# Altium schematic sheet Booster_RF_CH_SUP_CTRL.SchDoc: Booster RF channel
size 420 x 297 mm; Author: G.K.; CompanyName: WUT; DrawnBy: G.K.; Organization: CERN; Address1: Warsaw Univeristy of Technology; Address2: Nowowiejska 15/19; Revision: -; SheetNumber: -; SheetTotal: -; EDA_Number: ARTIQ; Projet: ADC/DAC MEZZANINE; ModifiedBy: -; CreateDate: XX/XX/XXXX; CheckedDate: -; Title2: supply & control; DivGrp: ISE; Designer: G.K.; ModifiedDate: -; ProjectName: ADC/DAC MEZZANINE
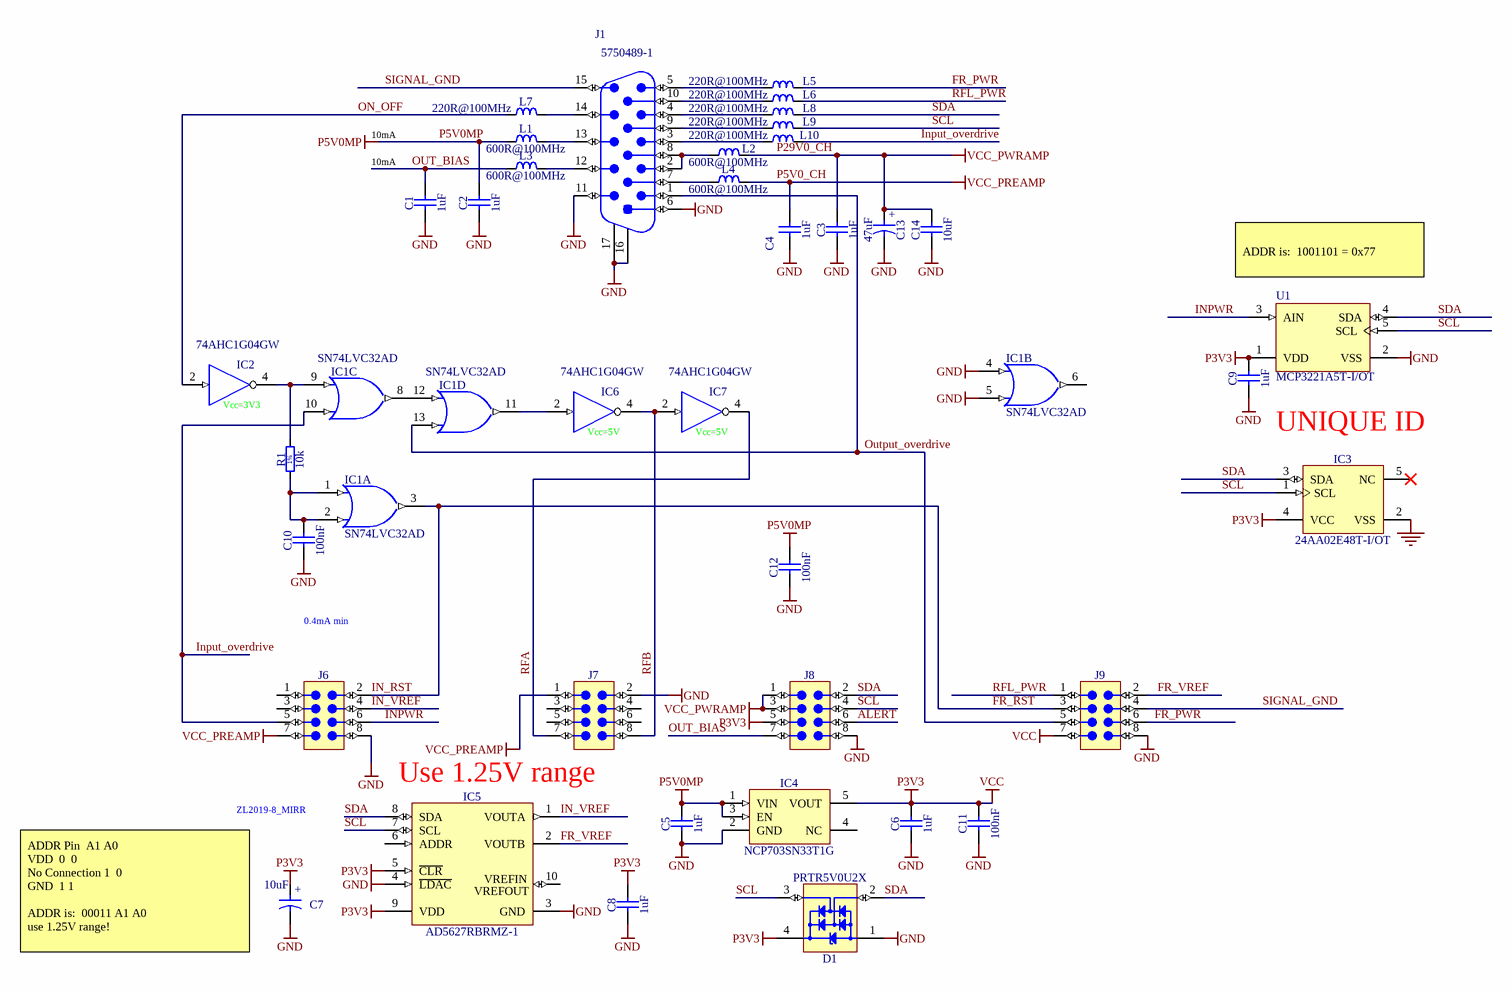
[diagram p0: Booster_RF_CH_SUP_CTRL.SchDoc]

## Parts
C1  1uF  [CAPC2012X110N]
C2  1uF  [CAPC2012X110N]
C3  1uF  [CAPC2012X110N]
C4  1uF  [CAPC2012X110N]
C5  1uF  [CAPC2012X140N]
C6  1uF  [CAPC2012X140N]
C7  10uF  [CAPMP3216X180N]
C8  1uF  [CAPC2012X140N]
C9  1uF  [CAPC2012X140N]
C10  100nF  [CAPC1005X55N]
C11  100nF  [CAPC1005X55N]
C12  100nF  [CAPC1005X55N]
C13  47uF  [CAPMP7343X430N]
C14  10uF  [CAPC3216X190N]
D1  PRTR5V0U2X  [SOT190P230X110-4N]
IC1  SN74LVC32AD  [SOIC127P600X175-14N]  (parts A,B,C,D of 4)
IC2  74AHC1G04GW  [SOT65P212X110-5N]
IC3  24AA02E48T-I/OT  [SOT95P280X145-5N]
IC4  NCP703SN33T1G  [SOT95P275X110-5N]
IC5  AD5627RBRMZ-1  [SOP50P490X110-10N]
IC6  74AHC1G04GW  [SOT65P212X110-5N]
IC7  74AHC1G04GW  [SOT65P212X110-5N]
J1  Manufacturer Part Number: 5750489-1  [TYCO_5750489-1]  (hidden comment: HD-Sub)
J6  Header 8  [ZL2019-8_MIRR]  (value not drawn)
J7  Header 8  [ZL2019-8_MIRR]  (value not drawn)
J8  Header 8  [ZL2019-8_MIRR]  (value not drawn)
J9  Header 8  [ZL2019-8_MIRR]  (value not drawn)
L1  600R@100MHz  [INDC3216X130N]
L2  600R@100MHz  [INDC3216X130N]
L3  600R@100MHz  [INDC3216X130N]
L4  600R@100MHz  [INDC3216X130N]
L5  220R@100MHz  [INDC1005X55N]
L6  220R@100MHz  [INDC1005X55N]
L7  220R@100MHz  [INDC1005X55N]
L8  220R@100MHz  [INDC1005X55N]
L9  220R@100MHz  [INDC1005X55N]
L10  220R@100MHz  [INDC1005X55N]
R1  10k  [RESC1608X55N]
U1  MCP3221A5T-I/OT  [SOT-23-OT5_L]

## Nets
GND: C1.1 C2.1 C3.1 C4.1 C5.1 C6.1 C7.2 C8.1 C9.1 C10.1 C11.1 C12.1 C13.2 C14.1 D1.1(GND) IC1.4(A) IC1.5(B) IC1.7(GND) IC2.3(GND) IC3.2(VSS) IC4.2(GND) IC5.3(GND) IC5.4(~{LDAC}) IC6.3(GND) IC7.3(GND) J1.6 J1.11 J1.16 J1.17 J6.8 J7.2 J8.8 J9.8 U1.2(VSS)
P3V3: C6.2 C7.1 C8.2 C9.2 C11.2 D1.4(VCC) IC1.14(VCC) IC2.5(VCC) IC3.4(VCC) IC4.5(VOUT) IC5.5(~{CLR}) IC5.9(VDD) J8.5 J9.7 U1.1(VDD)  [also labelled VCC]
P5V0_CH: C4.2 J6.7 J7.1 L4.2  [also labelled VCC_PREAMP]
P5V0MP: C2.2 C5.2 C12.2 IC4.1(VIN) IC4.3(EN) IC6.5(VCC) IC7.5(VCC) L1.1
P29V0_CH: C3.2 C13.1 C14.2 J8.1 J8.3 L2.2  [also labelled VCC_PWRAMP]
ALERT: J8.6
FR_PWR: J9.6 L5.2
FR_RST: IC1.3(Y) J6.2 J9.3  [also labelled IN_RST]
FR_VREF: IC5.2(VOUTB) J9.2
IN_VREF: IC5.1(VOUTA) J6.4
Input_overdrive: IC1.10(B) J6.5 L10.2
INPWR: J6.6 U1.3(AIN)
ON_OFF: IC2.2(IN) L7.1
OUT_BIAS: C1.2 J8.7 L3.1
Output_overdrive: IC1.13(B) J1.1 J9.5
RFA: IC7.4(OUT) J7.7
RFB: IC6.4(OUT) IC7.2(IN) J7.8
RFL_PWR: J9.1 L6.2
SCL: D1.3(I/O2) IC3.1(SCL) IC5.7(SCL) J8.4 L9.2 U1.5(SCL)
SDA: D1.2(I/O1) IC3.3(SDA) IC5.8(SDA) J8.2 L8.2 U1.4(SDA)
SIGNAL_GND: J1.15 J9.4
NetC10_2: C10.2 IC1.1(A) IC1.2(B) R1.1
NetIC1_8: IC1.8(Y) IC1.12(A)
NetIC1_9: IC1.9(A) IC2.4(OUT) R1.2
NetIC1_11: IC1.11(Y) IC6.2(IN)
NetJ1_2: J1.2 J1.8 L2.1
NetJ1_3: J1.3 L10.1
NetJ1_4: J1.4 L8.1
NetJ1_5: J1.5 L5.1
NetJ1_7: J1.7 L4.1
NetJ1_9: J1.9 L9.1
NetJ1_10: J1.10 L6.1
NetJ1_12: J1.12 L3.2
NetJ1_13: J1.13 L1.2
NetJ1_14: J1.14 L7.2

Not connected (* = marked no-connect by the designer): IC1 6(Y); IC3 5(NC)*; IC4 4(NC); IC5 6(ADDR) 10(VREFIN/VREFOUT); J6 1 3; J7 3 4 5 6

## Notes on the sheet
- (near C1) 10mA
- 10mA
- (near U1) ADDR is:  1001101 = 0x77
- (near IC2) Vcc=3V3
- (near IC6) Vcc=5V
- (near IC7) Vcc=5V
- UNIQUE ID
- 0.4mA min
- Use 1.25V range
- ZL2019-8_MIRR
- (near C7) ADDR Pin		A1	A0
  VDD		0 	0
  No Connection	1 	0
  GND		1	1
  ADDR is:  00011 A1 A0
  use 1.25V range!
- Project/Equipment
- Document
- Designer
- Drawn by
- Check.by
- File
- Last Mod.
- Print Date
- Sheet
- Size
- A3
- of
- Rev
- (in symbol AD5627RBRMZ-1) VREFIN; VREFOUT
- (in symbol CTE3216-18_10UF_16V_20%_AVX_TCJ) +
- (in symbol CTE7343-43_47UF_35V_10%_LESR0300) +
- (in symbol R0603_10K_1%_0.1W_100PPM) 1%

## Library data of the parts
C1-C4 = CC0805_1UF_50V_10%_X7R: Non-polarised capacitor; Part Description: SMD Multilayer Chip Ceramic Capacitor; Manufacturer: GENERIC; Manufacturer1 Part Number: C0805C105K5RACTU; Voltage: 50V; TC: X7R; Tolerance: ±10%; Part Number: CC0805_1UF_50V_10%_X7R; Component Kind: Standard; Component Type: Standard; Pin Count: 2; Value: 1uF; Status: Preferred; Manufacturer Part Number: CC0805_1UF_50V_10%_X7R; Case: 0805; Mounted: Yes; Socket: No; SMD: Yes; Sense: No; Manufacturer1 Example: KEMET; Manufacturer1 ComponentHeight: 1.1mm; HelpURL: \\cern.ch\dfs\Applications\Altium\Datasheets\CC0805_X7R_KEMET.pdf; Author: CERN DEM JLC; CreateDate: 04.12.2013; LatestRevisionDate: 04.12.2013
C5 C6 C8 C9 = CC0805_1UF_35V_20%_X7R: Non-polarised capacitor; Part Description: SMD Multilayer Chip Ceramic Capacitor; Manufacturer: GENERIC; Manufacturer1 Part Number: GMK212B7105MG-T; Voltage: 35V; TC: X7R; Tolerance: ±20%; Part Number: CC0805_1UF_35V_20%_X7R; Component Kind: Standard; Component Type: Standard; Pin Count: 2; Value: 1uF; Status: Not Recommended; Manufacturer Part Number: CC0805_1UF_35V_20%_X7R; Case: 0805; Mounted: Yes; Socket: No; SMD: Yes; Sense: No; Manufacturer1 Example: TAIYO YUDEN; Manufacturer1 ComponentHeight: 1.35mm; HelpURL: \\cern.ch\dfs\Applications\Altium\Datasheets\CC0805_X7R_TAIYO-YUDEN_HIGH-VALUE.pdf; Author: CERN DEM JLC; CreateDate: 22.06.2011; LatestRevisionDate: 22.06.2011
C7 = CTE3216-18_10UF_16V_20%_AVX_TCJ: Polarised capacitor; Part Description: ESR 0R200 Tantalum Solid Electrolytic Chip Capacitor with Conductive Polymer Electrode; Manufacturer: AVX; Manufacturer Part Number: TCJA106M016R0200; Voltage: 16V; Tolerance: ±20%; Part Number: CTE3216-18_10UF_16V_20%_AVX_TCJ; Component Kind: Standard; Component Type: Standard; Pin Count: 2; Value: 10uF; Status: Preferred; Case: A; Mounted: Yes; Socket: No; SMD: Yes; Sense: No; ComponentHeight: 1.8mm; HelpURL: \\cern.ch\dfs\Applications\Altium\Datasheets\CTE_AVX_TCJ.pdf; Author: CERN DEM JLC; CreateDate: 29.03.2012; LatestRevisionDate: 29.03.2012
C10-C12 = CC0402_100NF_16V_10%_X5R: Non-polarised capacitor; Part Description: SMD Multilayer Chip Ceramic Capacitor; Manufacturer: GENERIC; Manufacturer1 Part Number: GRM155R61C104KA88D; Voltage: 16V; TC: X5R; Tolerance: ±10%; Part Number: CC0402_100NF_16V_10%_X5R; Component Kind: Standard; Component Type: Standard; Pin Count: 2; Value: 100nF; Status: None; Manufacturer Part Number: CC0402_100NF_16V_10%_X5R; Case: 0402; Mounted: Yes; Socket: No; SMD: Yes; Sense: No; Manufacturer1 Example: MURATA; Manufacturer1 ComponentHeight: 0.55mm; HelpURL: \\cern.ch\dfs\Applications\Altium\Datasheets\CC0402_X5R_MURATA_GRM.pdf; Author: CERN DEM JLC; CreateDate: 10.12.2013; LatestRevisionDate: 10.12.2013
C13 = CTE7343-43_47UF_35V_10%_LESR0300: Polarised capacitor; Part Description: ESR 0R3 Solid Tantalum Chip Capacitor; Manufacturer: GENERIC; Manufacturer1 Part Number: T495X476K035ATE300; Voltage: 35V; Tolerance: ±10%; Part Number: CTE7343-43_47UF_35V_10%_LESR0300; Component Kind: Standard; Component Type: Standard; Pin Count: 2; Value: 47uF; Status: Preferred; Manufacturer Part Number: CTE7343-43_47UF_35V_10%_LESR0300; Case: E; Mounted: Yes; Socket: No; SMD: Yes; Sense: No; Manufacturer1 Example: AVX; Manufacturer1 ComponentHeight: 4.3mm; HelpURL: \\cern.ch\dfs\Applications\Altium\Datasheets\CTEB_KEMET_T495.pdf; Author: CERN DEM JLC; CreateDate: 27.05.2013; LatestRevisionDate: 27.05.2013
C14 = CC1206_10UF_50V_10%_X5R_TDK_CGA5L3X5R1H106K160AB: Non-polarised capacitor; Part Description: SMD Multilayer Chip Ceramic Capacitor (Automotive Grade); Manufacturer: TDK; Voltage: 50V; TC: X5R; Tolerance: ±10%; Part Number: CC1206_10UF_50V_10%_X5R_TDK_CGA5L3X5R1H106K160AB; Component Kind: Standard; Component Type: Standard; Pin Count: 2; Value: 10uF; Status: Not Recommended; Manufacturer Part Number: CGA5L3X5R1H106K160AB; Case: 1206; Mounted: Yes; Socket: No; SMD: Yes; Sense: No; ComponentHeight: 1.9mm; HelpURL: \\cern.ch\dfs\Applications\Altium\Datasheets\CC1206_X5R_TDK_CGA.pdf; Author: CERN DEM BC; CreateDate: 29.02.2016; LatestRevisionDate: 13.09.2016
D1 = PRTR5V0U2X: Ultra Low Capacitance Double Rail-to-Rail ESD Protection Diode; Part Description: Ultra Low Capacitance (1pF) Double Rail-to-Rail ESD Protection Diode (8kV); Manufacturer: NXP SEMICONDUCTORS; Voltage: 5.5V; PressFit: No; Bonding: No; Part Number: PRTR5V0U2X; Component Kind: Standard; Component Type: Standard; Device: PRTR5V0U2X; PackageDescription: SOT143B, SOT, 1.90mm Pitch; 4 Pin, 1.30mm W X 2.90mm L X 1.10mm H body, IPC Medium Density; Manufacturer Part Number: PRTR5V0U2X; Pin Count: 4; Case: SOT143B; Mounted: Yes; Socket: No; SMD: Yes; Sense: No; ComponentHeight: 1.1mm; HelpURL: \\cern.ch\dfs\Applications\Altium\Datasheets\PRTR5V0U2X.pdf; Author: CERN DEM JLC; CreateDate: 22.03.2011; LatestRevisionDate: 22.03.2011
IC1 = SN74LVC32AD: Quad 2-Input OR Gate; Part Description: Quad 2-Input Positive-OR Gate; Manufacturer: TEXAS INSTRUMENTS; PressFit: No; Bonding: No; Part Number: SN74LVC32AD; Component Kind: Standard; Component Type: Standard; Device: SN74LVC32AD; PackageDescription: SOIC 14, Pitch 1.27mm - Body 4x8.75mm, IPC Medium Density; Manufacturer Part Number: SN74LVC32AD; Pin Count: 14; Case: SOIC14; Mounted: Yes; Socket: No; SMD: Yes; Sense: No; ComponentHeight: 1.75mm; Author: CERN DEM JLC; HelpURL: \\cern.ch\dfs\Applications\Altium\Datasheets\SN74LVC32AD.pdf; CreateDate: 21.03.2012; LatestRevisionDate: 21.03.2012
IC2 IC6 IC7 = 74AHC1G04GW: Single Inverter Buffer; Manufacturer: NXP SEMICONDUCTORS; PressFit: No; Bonding: No; Part Number: 74AHC1G04GW; Component Kind: Standard; Component Type: Standard; Device: 74AHC1G04GW; PackageDescription: SOT353, SOT, 0.65mm Pitch, 5 pin, 1.25mm W X 2.05mm L X 1.10mm H, IPC Medium Density; Part Description: Single Inverter Buffer; Manufacturer Part Number: 74AHC1G04GW; Pin Count: 3; Case: SOT353; Mounted: Yes; Socket: No; SMD: Yes; Sense: No; ComponentHeight: 1.1mm; Author: CERN DEM JLC; HelpURL: \\cern.ch\dfs\Applications\Altium\Datasheets\74AHC1G04GW.pdf; CreateDate: 03.03.2010; LatestRevisionDate: 03.03.2010
IC3 = 24AA02E48T-I/OT: 1.7V-5.5V, 2K I2C Serial EEPROM With EUI-48 Node Identity; Manufacturer: MICROCHIP TECHNOLOGY; PressFit: No; Bonding: No; Part Number: 24AA02E48T-I/OT; Component Kind: Standard; Component Type: Standard; Device: 24AA02E48T-I/OT; PackageDescription: SOT, 0.95mm pitch; 5 pin, 1.60mm W X 2.90mm L X 1.45mm H body, IPC Medium Density; Part Description: 1.7V-5.5V, 2K I2C Serial EEPROM With EUI-48 Node Identity; Manufacturer Part Number: 24AA02E48T-I/OT; Pin Count: 5; Case: SOT23-5; Mounted: Yes; Socket: No; SMD: Yes; Sense: No; ComponentHeight: 1.45mm; HelpURL: \\cern.ch\dfs\Applications\Altium\Datasheets\24AA02E48T-I-OT.pdf; Author: CERN DEM MR; CreateDate: 2016-03-31; LatestRevisionDate: 2016-03-31
IC4 = NCP703SN33T1G: 3.3V 300mA, Ultra-Low Quiescent Current, IQ 12uA, Ultra-Low Noise, LDO Voltage Regulator; Manufacturer: ON SEMICONDUCTOR; PressFit: No; Bonding: No; Part Number: NCP703SN33T1G; Component Kind: Standard; Component Type: Standard; Device: NCP703SN33T1G; PackageDescription: SOT, 0.95mm Pitch; 5 Pin, 1.50mm W X 3.00mm L X 1.10mm H Body, IPC Medium Density; Part Description: 3.3V 300mA, Ultra-Low Quiescent Current, IQ 12uA, Ultra-Low Noise, LDO Voltage Regulator; Manufacturer Part Number: NCP703SN33T1G; Pin Count: 5; Case: SOT23-5; Mounted: Yes; Socket: No; SMD: Yes; Sense: No; ComponentHeight: 1.1mm; HelpURL: \\cern.ch\dfs\Applications\Altium\Datasheets\NCP703SN33T1G.pdf; Author: CERN DEM JLC; CreateDate: 16.02.2017; LatestRevisionDate: 16.02.2017
IC5 = AD5627RBRMZ-1: Dual, 12-/14-/16-Bit nanoDACs® with 5 ppm/°C On-Chip Reference, I2C Interface; Part Description: Dual, 12-Bit nanoDACs® with 5 ppm/°C On-Chip Reference, I2C Interface; Manufacturer: ANALOG DEVICES; PressFit: No; Bonding: No; Part Number: AD5627RBRMZ-1; Component Kind: Standard; Component Type: Standard; Device: AD5627RBRMZ-1; PackageDescription: TSSOP, 10-Leads, Body 3.2x3.2mm (max), Pitch 0.50mm, IPC Medium Density; Manufacturer Part Number: AD5627RBRMZ-1; Pin Count: 10; Case: MSOP10; Mounted: Yes; Socket: No; SMD: Yes; Sense: No; ComponentHeight: 1.1mm; Author: CERN DEM JLC; HelpURL: \\cern.ch\dfs\Applications\Altium\Datasheets\AD5627RBRMZ-1.pdf; CreateDate: 18.12.2013; LatestRevisionDate: 18.12.2013
J1 = CON_DB15_V_M_5750489-1: Connector High Density D-sub 15 Male; Part Description: 15 Male Contacts, Straight High Density D-SUB Connector, AMPLIMITE HD-22 Serie; Manufacturer: TYCO ELECTRONICS; PressFit: No; Part Number: TYCO_5750489-1; Component Kind: Standard; Component Type: Standard; Pin Count: 17; Family: HD-Sub; Mounted: Yes; Socket: No; SMD: No; Sense: No; Status: None; ComponentHeight: 12.75mm; HelpURL: \\cern.ch\dfs\Applications\Altium\Datasheets\TYCO_1-1734530-1.pdf; Author: GK; CreateDate: 26.06.2013; LatestRevisionDate: 26.06.2013
J6-J9 = CON_2x4 2.54 male MIRROR: Connector 8 Male; Part Number: ZL2019-8; Part Description: 8 Contacts, Pitch 2.54mm, Dual Row  Through Mount Straight Header (Post Lead 5.84mm, Tail Lead 2.92mm, Insulator 2.54mm); Manufacturer: NINIGI; PressFit: No; Component Kind: Standard; Component Type: Standard; Pin Count: 8; Family: Header 8; Mounted: Yes; Socket: No; Sense: No; SMD: No; Status: None; Manufacturer Part Number: ZL2019-8; ComponentHeight: 19.4; HelpURL: \\cern.ch\dfs\Applications\Altium\Datasheets\SAMTEC_TSW-104-23-L-D.pdf; Author: GK; CreateDate: 08.03.2017; LatestRevisionDate: 08.03.2017
L1-L4 = IND1206_WURTH_74279218: Inductor; Part Description: SMD EMI Suppression Chip Ferrite Bead (WE-CBF Series); Manufacturer: WURTH ELEKTRONIK; Power: 2A; Resistance: 0.1R; Tolerance: ±25%; Part Number: IND1206_WURTH_74279218; Component Kind: Standard; Component Type: Standard; Pin Count: 2; Value: 600R@100MHz; Status: None; Manufacturer Part Number: 74279218; Case: 1206; Mounted: Yes; Socket: No; SMD: Yes; Sense: No; ComponentHeight: 1.3mm; HelpURL: \\cern.ch\dfs\Applications\Altium\Datasheets\IND1206_WURTH_74279218.pdf; Author: CERN DEM JLC; CreateDate: 24.01.2012; LatestRevisionDate: 24.01.2012
L5-L10 = IND0402_MURATA_BLM15HB221SN1: Inductor; Part Description: SMD EMIFIL Suppression Chip Ferrite Bead; Manufacturer: MURATA; Power: 250mA; Resistance: 1R; Tolerance: ±25%; Part Number: IND0402_MURATA_BLM15HB221SN1; Component Kind: Standard; Component Type: Standard; Pin Count: 2; Value: 220R@100MHz; Status: None; Manufacturer Part Number: BLM15HB221SN1; Case: 0402; Mounted: Yes; Socket: No; SMD: Yes; Sense: No; ComponentHeight: 0.55mm; HelpURL: \\cern.ch\dfs\Applications\Altium\Datasheets\IND0402_MURATA_BLM15H.pdf; Author: CERN DEM JLC; CreateDate: 23.06.2009; LatestRevisionDate: 23.06.2009
R1 = R0603_10K_1%_0.1W_100PPM: Resistor - 1%; Part Description: General Purpose Thick Film Chip Resistor; Manufacturer: GENERIC; Manufacturer1 Part Number: NRC06F1002TRF; Power: 0.1W; TC: ±100ppm/°C; PressFit: No; Part Number: R0603_10K_1%_0.1W_100PPM; Component Kind: Standard; Component Type: Standard; Pin Count: 2; Value: 10k; Status: Preferred; Tolerance: ±1%; Manufacturer Part Number: R0603_10K_1%_0.1W_100PPM; Case: 0603; Mounted: Yes; Sense: No; Socket: No; SMD: Yes; Manufacturer1 Example: NIC COMPONENT; Manufacturer1 ComponentHeight: 0.55mm; HelpURL: \\cern.ch\dfs\Applications\Altium\Datasheets\R0603_NIC_NRC.pdf; Author: CERN DEM JLC; CreateDate: 03.12.2007; LatestRevisionDate: 13.03.2008
U1 = CMP-0188-00733-2: Low Power 12-Bit A/D Converter With I2C Interface, 5-Pin SOT-23, Industrial Temperature, Tape and Reel; ComponentLink1URL: http://www.microchip.com/; ComponentLink2URL: http://ww1.microchip.com/downloads/en/DeviceDoc/21732c.pdf; PackageVersion: revBB, Aug-2009; PackageDescription: 5-Lead Plastic Small Outline Transistor (OT) [SOT-23]; ComponentLink2Description: Datasheet; ComponentLink1Description: Manufacturer URL; RevisionNote: URLs added.; DatasheetVersion: revC, Jul-2006; PackageReference: SOT-23-OT5; ComponentLink3Description: Package Specification; Code_IPC: SOT23-5; ComponentLink3URL: http://www.microchip.com/stellent/groups/techpub_sg/documents/packagingspec/en012702.pdf